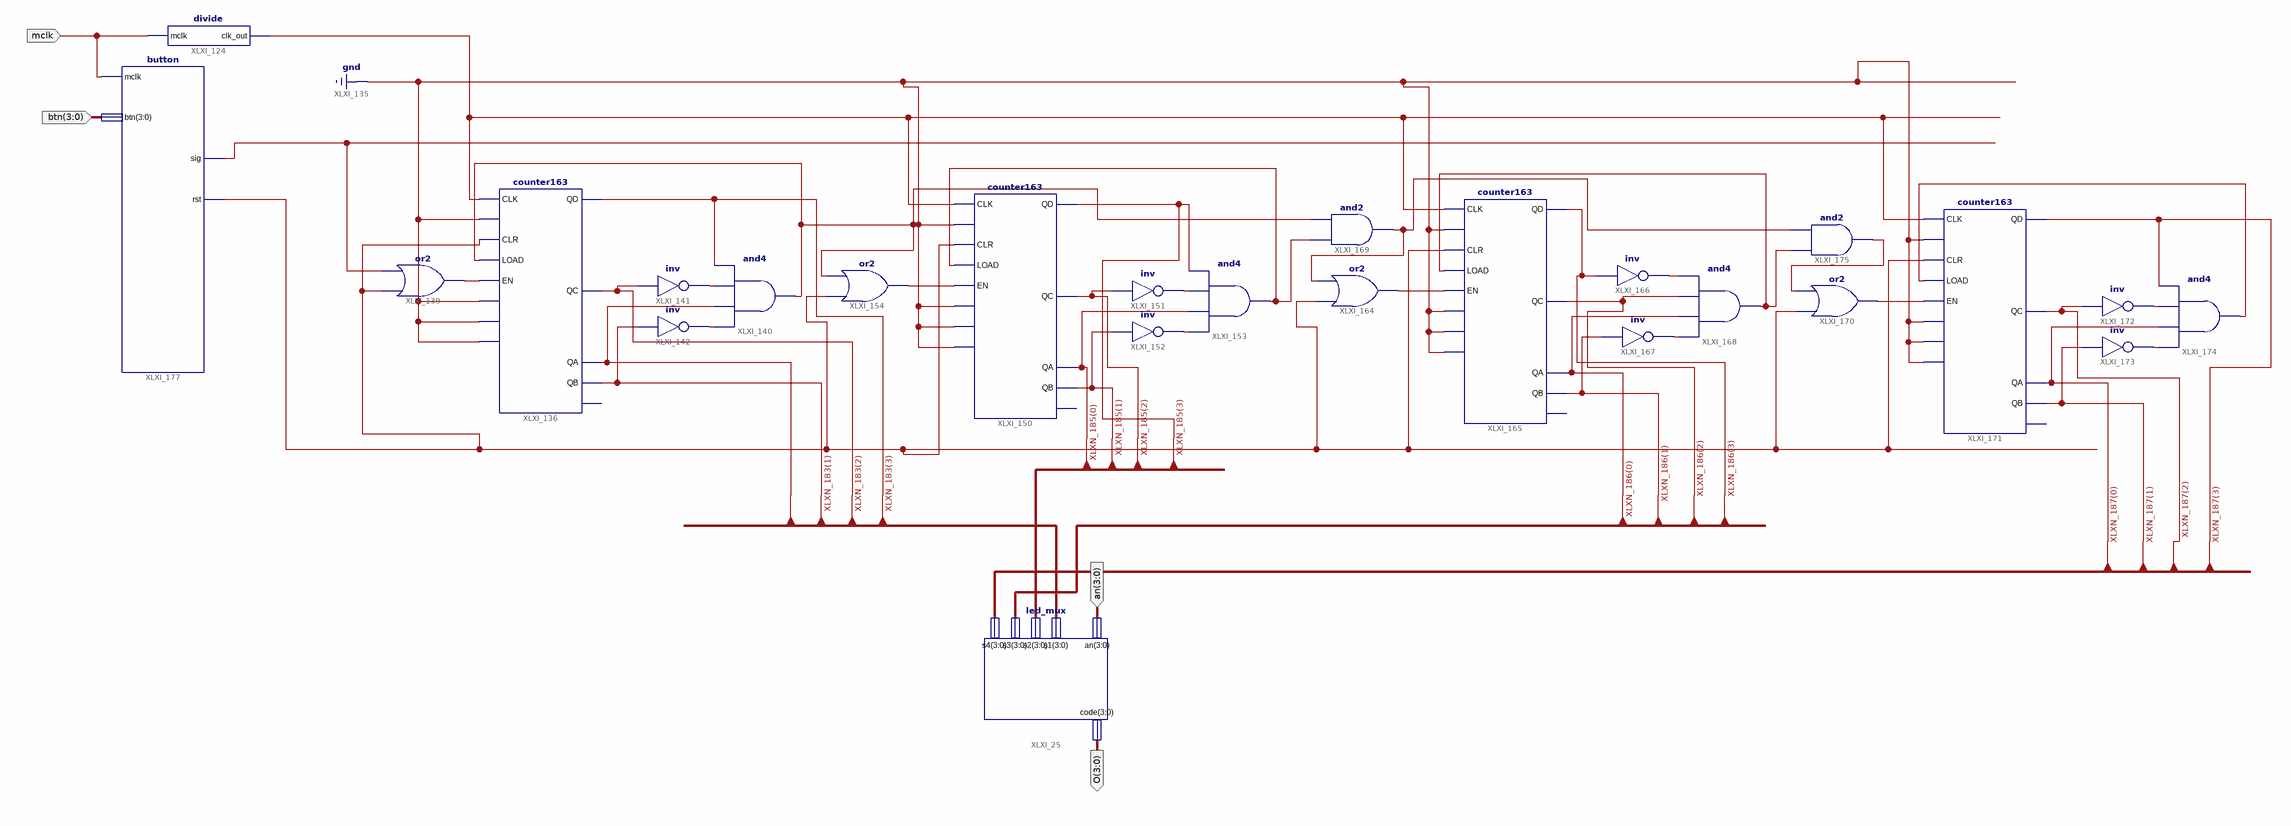
[diagram p0: schematic sheet 1]
// Xilinx ISE schematic timer.sch (spartan3e) as structural Verilog: 25 symbols, 4 ports
module timer (
  input  [3:0] an,
  input  mclk,
  input  [3:0] btn,
  output [3:0] O
);

  wire rst, sig, XLXN_77, XLXN_82, XLXN_83, XLXN_103, XLXN_105, XLXN_106, XLXN_110, XLXN_115, XLXN_140,
       XLXN_141, XLXN_143, XLXN_147, XLXN_155, XLXN_156, XLXN_157, XLXN_158, XLXN_162, XLXN_167, XLXN_200;
  wire [3:0] XLXN_183, XLXN_185, XLXN_186, XLXN_187;

  or XLXI_139 (XLXN_77, rst, sig);
  counter163 XLXI_136 (
    .CLK(XLXN_200), .A(1'b0), .CLR(rst), .LOAD(XLXN_115), .EN(XLXN_77), .B(1'b0), .C(1'b0), .D(1'b0),
    .QD(XLXN_183[3]), .QC(XLXN_183[2]), .QA(XLXN_183[0]), .QB(XLXN_183[1]));  // open: RCD
  not XLXI_141 (XLXN_82, XLXN_183[2]);
  not XLXI_142 (XLXN_83, XLXN_183[1]);
  and XLXI_140 (XLXN_115, XLXN_83, XLXN_183[0], XLXN_82, XLXN_183[3]);
  or XLXI_154 (XLXN_103, rst, XLXN_115);
  counter163 XLXI_150 (
    .CLK(XLXN_200), .A(1'b0), .CLR(rst), .LOAD(XLXN_110), .EN(XLXN_103), .B(1'b0), .C(1'b0), .D(1'b0),
    .QD(XLXN_185[3]), .QC(XLXN_185[2]), .QA(XLXN_185[0]), .QB(XLXN_185[1]));  // open: RCD
  not XLXI_151 (XLXN_105, XLXN_185[2]);
  not XLXI_152 (XLXN_106, XLXN_185[1]);
  and XLXI_153 (XLXN_110, XLXN_106, XLXN_185[0], XLXN_105, XLXN_185[3]);
  or XLXI_164 (XLXN_141, rst, XLXN_140);
  counter163 XLXI_165 (
    .CLK(XLXN_200), .A(1'b0), .CLR(rst), .LOAD(XLXN_147), .EN(XLXN_141), .B(1'b0), .C(1'b0), .D(1'b0),
    .QD(XLXN_186[3]), .QC(XLXN_186[2]), .QA(XLXN_186[0]), .QB(XLXN_186[1]));  // open: RCD
  not XLXI_167 (XLXN_143, XLXN_186[1]);
  and XLXI_168 (XLXN_147, XLXN_143, XLXN_186[0], XLXN_186[2], XLXN_167);
  and XLXI_169 (XLXN_140, XLXN_110, XLXN_115);
  or XLXI_170 (XLXN_156, rst, XLXN_155);
  counter163 XLXI_171 (
    .CLK(XLXN_200), .A(1'b0), .CLR(rst), .LOAD(XLXN_162), .EN(XLXN_156), .B(1'b0), .C(1'b0), .D(1'b0),
    .QD(XLXN_187[3]), .QC(XLXN_187[2]), .QA(XLXN_187[0]), .QB(XLXN_187[1]));  // open: RCD
  not XLXI_172 (XLXN_157, XLXN_187[2]);
  not XLXI_173 (XLXN_158, XLXN_187[1]);
  and XLXI_174 (XLXN_162, XLXN_158, XLXN_187[0], XLXN_157, XLXN_187[3]);
  and XLXI_175 (XLXN_155, XLXN_147, XLXN_140);
  not XLXI_166 (XLXN_167, XLXN_186[3]);
  led_mux XLXI_25 (.an(an), .code(O), .s1(XLXN_183), .s2(XLXN_185), .s3(XLXN_186), .s4(XLXN_187));
  divide XLXI_124 (.mclk(mclk), .clk_out(XLXN_200));
  button XLXI_177 (.mclk(mclk), .btn(btn), .sig(sig), .rst(rst));
endmodule
